# Altium schematic sheet MCU.SchDoc
size 420 x 297 mm; DocumentNumber: 4; SheetNumber: 4; SheetTotal: 13; DecimalNumber: СНАБ.468222.001 ЭЗ
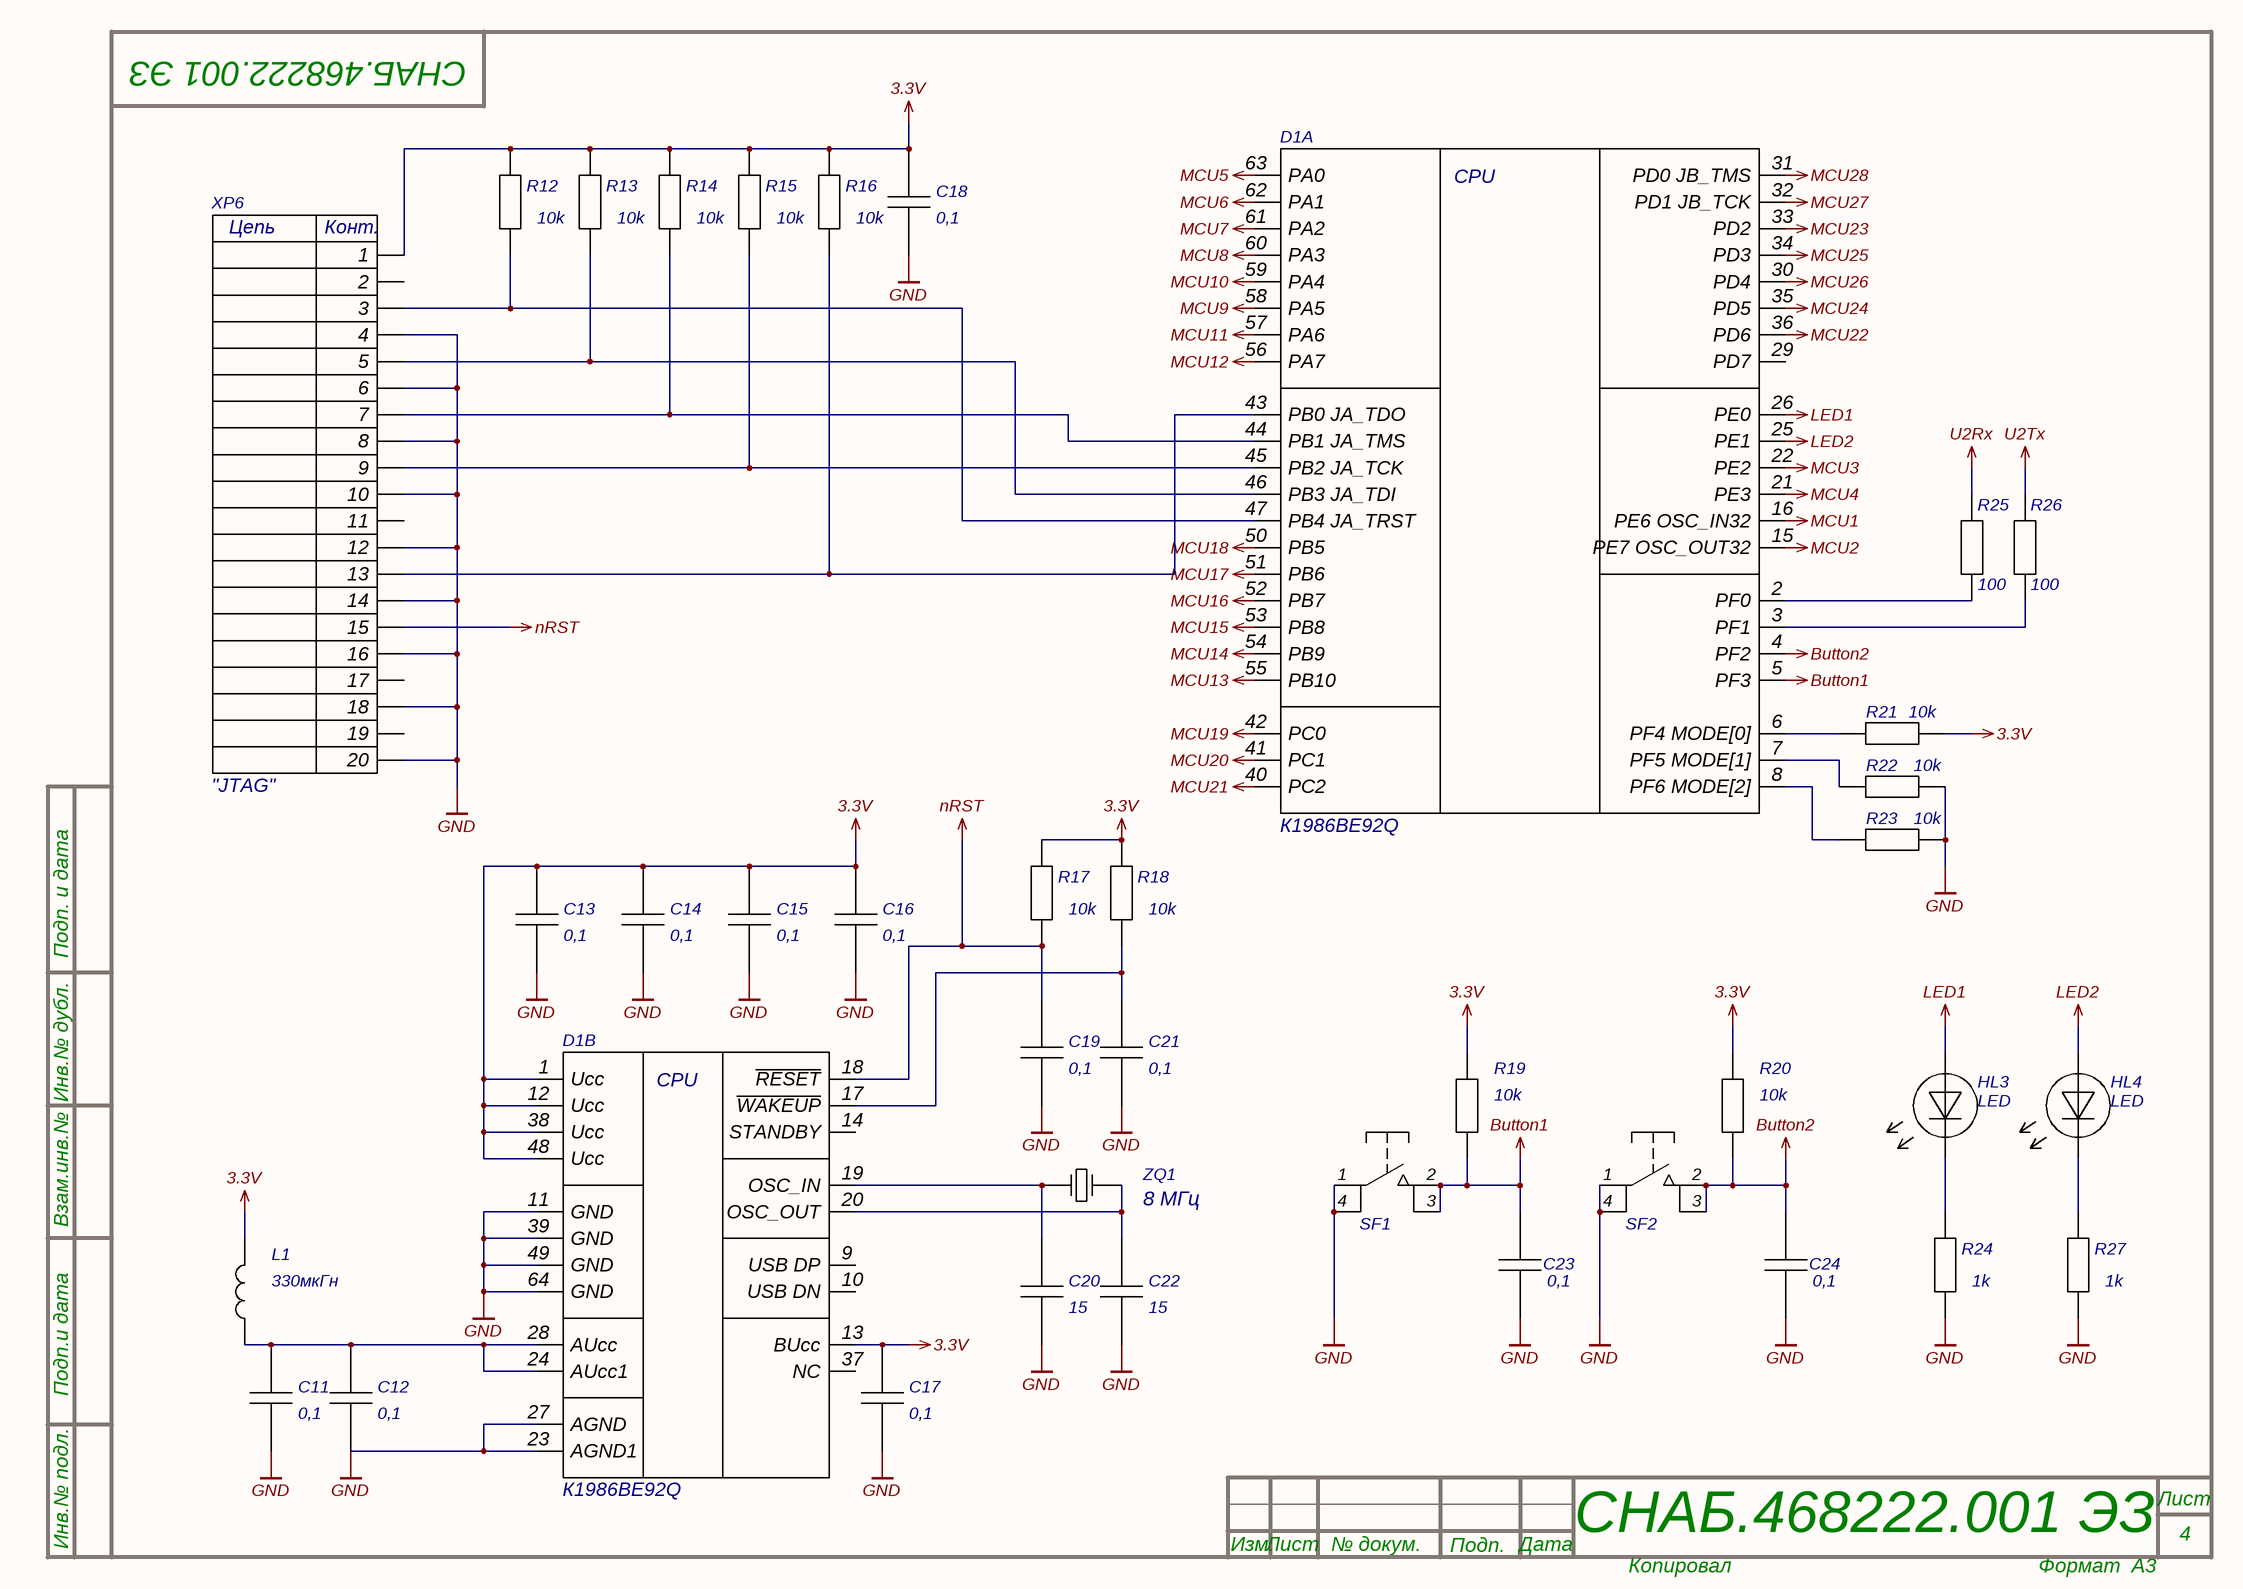
[diagram p0: MCU.SchDoc]

## Parts
C11  0,1  [C0603]
C12  0,1  [C0603]
C13  0,1  [C0603]
C14  0,1  [C0603]
C15  0,1  [C0603]
C16  0,1  [C0603]
C17  0,1  [C0603]
C18  0,1  [C0603]
C19  0,1  [C0603]
C20  15  [C0603]
C21  0,1  [C0603]
C22  15  [C0603]
C23  0,1  [C0603]
C24  0,1  [C0603]
D1  К1986ВЕ92Q  [LQFP64]  (parts A,B of 2)
HL3  LED  [LED 5mm (L-7113IT)]
HL4  LED  [LED 5mm (L-7113IT)]
L1  330мкГн  [LQH43M (1812)]
R12  10k  [R0805]
R13  10k  [R0805]
R14  10k  [R0805]
R15  10k  [R0805]
R16  10k  [R0805]
R17  10k  [R0805]
R18  10k  [R0805]
R19  10k  [R0603]
R20  10k  [R0603]
R21  10k  [R0805]
R22  10k  [R0805]
R23  10k  [R0805]
R24  1k  [R0805]
R25  100  [R0805]
R26  100  [R0805]
R27  1k  [R0805]
SF1  0650HIM-130G-G  [TC-0103]  (value not drawn)
SF2  0650HIM-130G-G  [TC-0103]  (value not drawn)
XP6  "JTAG"  [IDC_20]
ZQ1  8 МГц  [HC-49SM]

## Nets
3.3V: C13.2 C14.2 C15.2 C16.2 C17.2 C18.2 D1.1(Ucc) D1.12(Ucc) D1.13(BUcc) D1.38(Ucc) D1.48(Ucc) L1.2 R12.2 R13.2 R14.2 R15.2 R16.2 R17.2 R18.2 R19.1 R20.1 R21.2 XP6.1
Button1: C23.2 D1.5(PF3) R19.2 SF1.2 SF1.3
Button2: C24.2 D1.4(PF2) R20.2 SF2.2 SF2.3
GND: C11.1 C12.1 C13.1 C14.1 C15.1 C16.1 C17.1 C18.1 C19.1 C20.1 C21.1 C22.1 C23.1 C24.1 D1.11(GND) D1.23(AGND1) D1.27(AGND) D1.39(GND) D1.49(GND) D1.64(GND) R22.2 R23.2 R24.1 R27.1 SF1.1 SF1.4 SF2.1 SF2.4 XP6.4 XP6.6 XP6.8 XP6.10 XP6.12 XP6.14 XP6.16 XP6.18 XP6.20
LED1: D1.26(PE0) HL3.2(A)
LED2: D1.25(PE1) HL4.2(A)
MCU1: D1.16(PE6_OSC_IN32)
MCU2: D1.15(PE7_OSC_OUT32)
MCU3: D1.22(PE2)
MCU4: D1.21(PE3)
MCU5: D1.63(PA0)
MCU6: D1.62(PA1)
MCU7: D1.61(PA2)
MCU8: D1.60(PA3)
MCU9: D1.58(PA5)
MCU10: D1.59(PA4)
MCU11: D1.57(PA6)
MCU12: D1.56(PA7)
MCU13: D1.55(PB10)
MCU14: D1.54(PB9)
MCU15: D1.53(PB8)
MCU16: D1.52(PB7)
MCU17: D1.51(PB6)
MCU18: D1.50(PB5)
MCU19: D1.42(PC0)
MCU20: D1.41(PC1)
MCU21: D1.40(PC2)
MCU22: D1.36(PD6)
MCU23: D1.33(PD2)
MCU24: D1.35(PD5)
MCU25: D1.34(PD3)
MCU26: D1.30(PD4)
MCU27: D1.32(PD1_JB_TCK)
MCU28: D1.31(PD0_JB_TMS)
nRST: C19.2 D1.18(~{RESET}) R17.1 XP6.15
U2Rx: R25.2
U2Tx: R26.2
NetC11_2: C11.2 C12.2 D1.24(AUcc1) D1.28(AUcc) L1.1
NetC20_2: C20.2 D1.19(OSC_IN) ZQ1.1
NetC21_2: C21.2 D1.17(~{WAKEUP}) R18.1
NetC22_2: C22.2 D1.20(OSC_OUT) ZQ1.2
NetD1_2: D1.2(PF0) R25.1
NetD1_3: D1.3(PF1) R26.1
NetD1_6: D1.6(PF4_MODE[0]) R21.1
NetD1_7: D1.7(PF5_MODE[1]) R22.1
NetD1_8: D1.8(PF6_MODE[2]) R23.1
NetD1_43: D1.43(PB0_JA_TDO) R16.1 XP6.13
NetD1_44: D1.44(PB1_JA_TMS) R14.1 XP6.7
NetD1_45: D1.45(PB2_JA_TCK) R15.1 XP6.9
NetD1_46: D1.46(PB3_JA_TDI) R13.1 XP6.5
NetD1_47: D1.47(PB4_JA_TRST) R12.1 XP6.3
NetHL3_1: HL3.1(K) R24.2
NetHL4_1: HL4.1(K) R27.2

Not connected (* = marked no-connect by the designer): D1 9(USB_DP) 10(USB_DN) 14(STANDBY) 29(PD7) 37(NC); XP6 2 11 17 19

## Notes on the sheet
- Подп. и дата
- Инв.№ дубл.
- Взам.инв.№
- Подп.и дата
- Инв.№ подл.
- Изм.
- Лист
- № докум.
- Подп.
- Дата
- Копировал
- Формат  A3
- (in symbol JTAG_20 L) Цепь; Конт.
- (in symbol К1986ВЕ92QI(C)_2parts(LQFP64), part A) CPU
- (in symbol К1986ВЕ92QI(C)_2parts(LQFP64), part B) CPU

## Library data of the parts
C11-C24 = Chip Capasitor: Чип-конденсатор
  C11-C19 C21 C23 C24: Value: 0,1
  C20 C22: Value: 15
D1 = К1986ВЕ92QI(C)_2parts(LQFP64): 32бит микроконтроллер CortexM3; Manufacturer: АО «ПКК Миландр»; TU: ТСКЯ.431296.021СП; Case: LQFP64, пласт.; Name: К1986ВЕ92Q
HL3 HL4 = LED: Светодиод, d=5мм; Manufacturer: Kingbright; Name: L-7113IT; Case: L-7113IT; Datasheet: https://static.chipdip.ru/lib/771/DOC059771173.pdf
L1 = LQH43MN331K: Чип-индуктивность 95мА, 330мкГн 10%; Manufacturer: Murata Electronics; TU: JELF243A-0043P-01; Case: LQH43M (1812); Name: LQH43MN331K; Datasheet: https://static.chipdip.ru/lib/442/DOC012442357.pdf
R12-R27 = Chip Resistor: Чип-резистор
  R12-R23: Value: 10k
  R24 R27: Value: 1k
  R25 R26: Value: 100
SF1 SF2 = 0650HIM-130G-G: Кнопка тактовая, h=5мм; Manufacturer: Switronic Industrial; Name: 0613HIM-130G-G; Case: TC-0103; Datasheet: https://static.chipdip.ru/lib/154/DOC001154468.pdf
XP6 = JTAG_20 L: J-TAG Connector; Name: DS1013-20S; Manufacturer: *; Case: *
ZQ1 = QuartzRes: Кварцевый резонатор, 8 МГц; Manufacturer: SJK; Case: HC-49SM; Name: QuartzRes; Datasheet: https://static.chipdip.ru/lib/086/DOC053086711.pdf